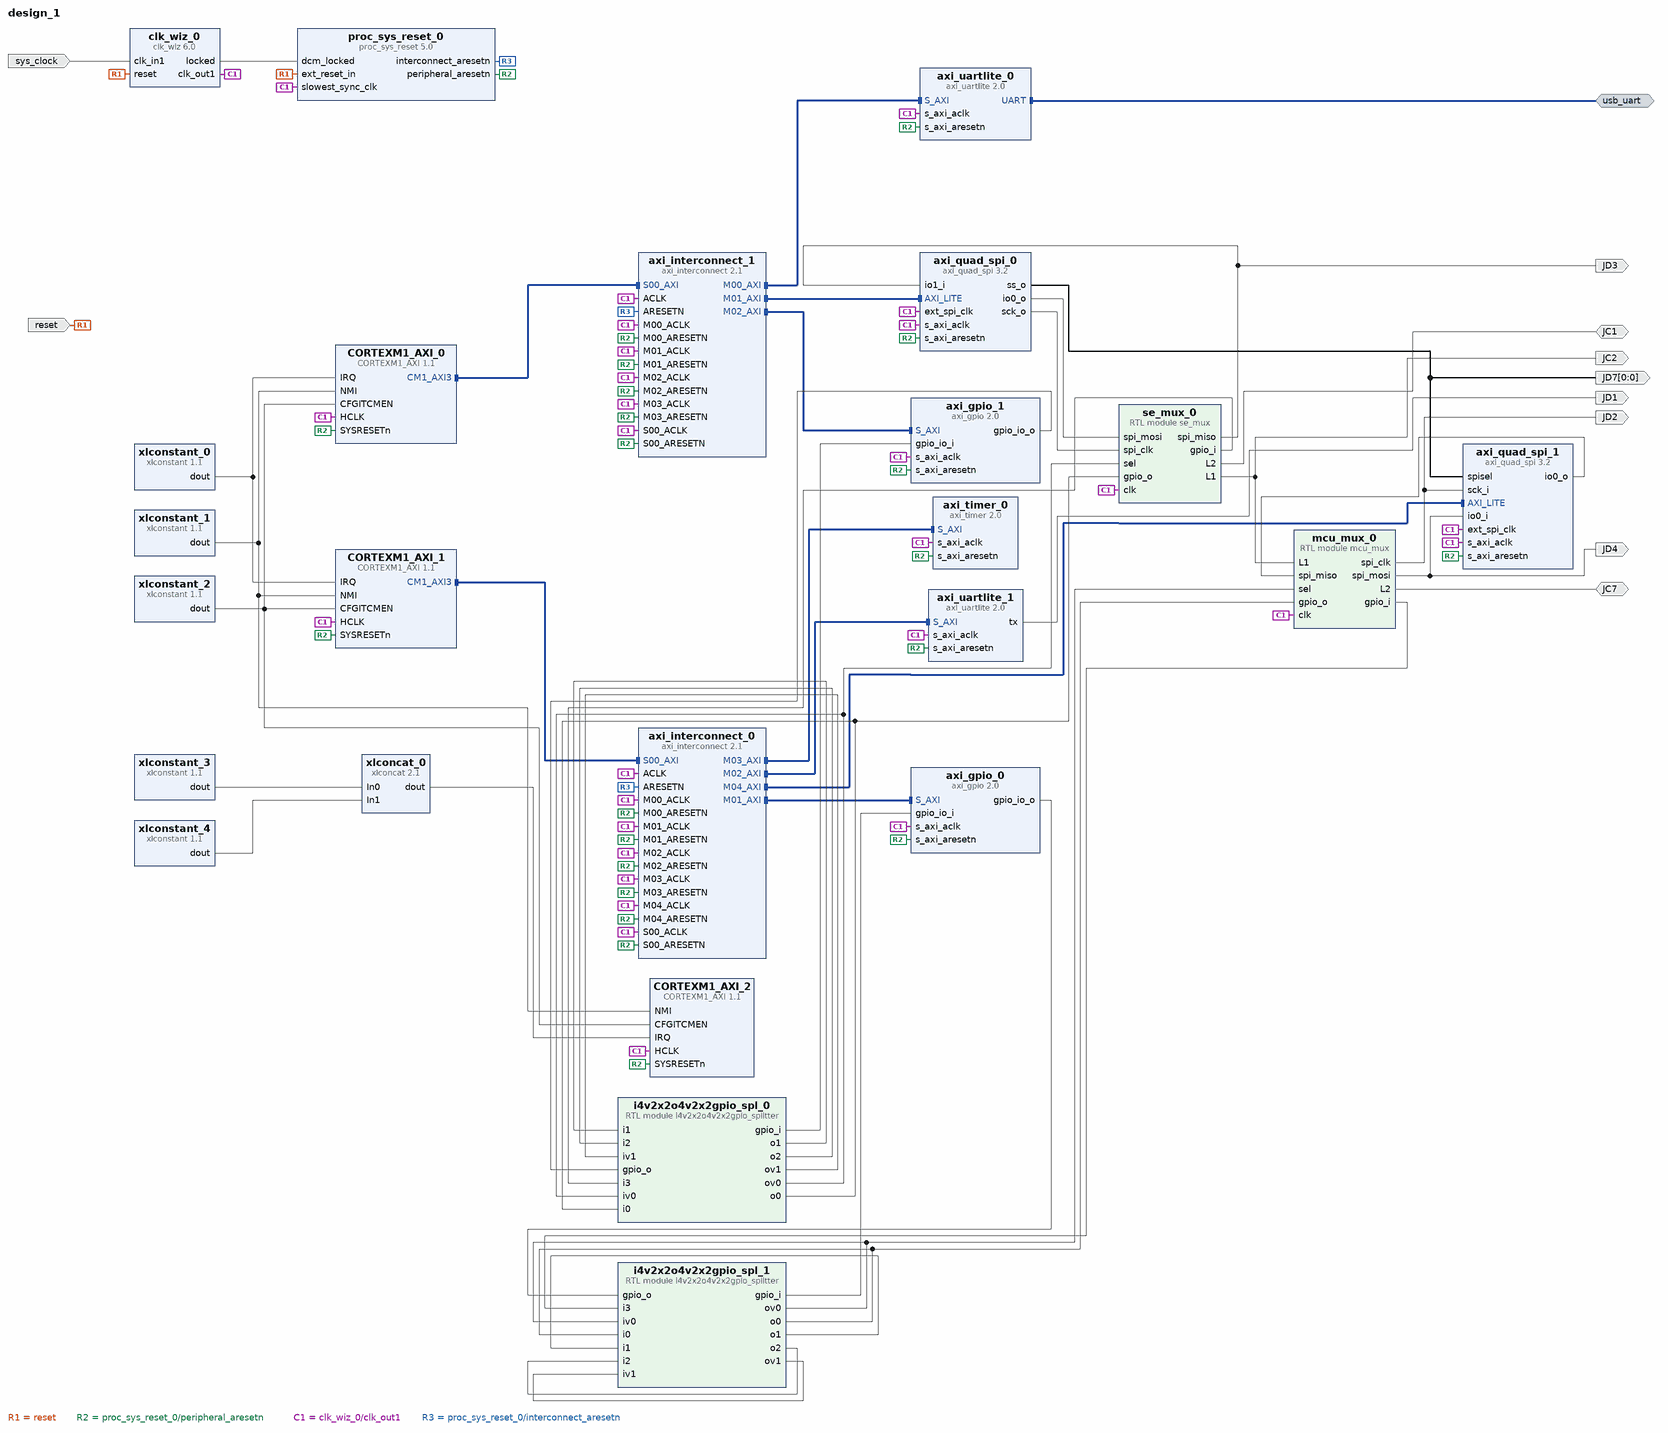
[diagram p0: block diagram of the top level]
# Vivado block design design_1, xc7a100tcsg324-1, Vivado 2019.1
create_bd_design design_1

create_bd_intf_port -mode Master -vlnv xilinx.com:interface:uart_rtl:1.0 usb_uart
create_bd_port -dir I -type clk sys_clock
set_property -dict {CONFIG.FREQ_HZ 100000000 CONFIG.PHASE 0.000} [get_bd_ports sys_clock]
create_bd_port -dir I -type rst reset
set_property -dict {CONFIG.POLARITY ACTIVE_HIGH} [get_bd_ports reset]
create_bd_port -dir O JD4
create_bd_port -dir O JD3
create_bd_port -dir O JD2
create_bd_port -dir O JD1
create_bd_port -dir O -from 0 -to 0 JD7
create_bd_port -dir IO JC1
create_bd_port -dir O JC2
create_bd_port -dir IO JC7

create_bd_cell -type ip -vlnv xilinx.com:ip:clk_wiz:6.0 clk_wiz_0
set_property -dict [list \
  CONFIG.CLK_IN1_BOARD_INTERFACE sys_clock \
  CONFIG.RESET_BOARD_INTERFACE reset \
  CONFIG.USE_BOARD_FLOW true \
] [get_bd_cells clk_wiz_0]
create_bd_cell -type ip -vlnv xilinx.com:ip:axi_interconnect:2.1 axi_interconnect_0
set_property -dict {CONFIG.NUM_MI 5} [get_bd_cells axi_interconnect_0]
create_bd_cell -type ip -vlnv xilinx.com:ip:proc_sys_reset:5.0 proc_sys_reset_0
create_bd_cell -type ip -vlnv xilinx.com:ip:xlconstant:1.1 xlconstant_1
set_property -dict {CONFIG.CONST_VAL 0} [get_bd_cells xlconstant_1]
create_bd_cell -type ip -vlnv xilinx.com:ip:xlconstant:1.1 xlconstant_2
set_property -dict {CONFIG.CONST_VAL 3 CONFIG.CONST_WIDTH 2} [get_bd_cells xlconstant_2]
create_bd_cell -type ip -vlnv arm.com:CortexM:CORTEXM1_AXI:1.1 CORTEXM1_AXI_1
set_property -dict [list \
  CONFIG.DEBUG_SEL 3 \
  CONFIG.ITCM_INIT_RAM true \
  CONFIG.OS true \
  CONFIG.SMALL_MUL false \
] [get_bd_cells CORTEXM1_AXI_1]
create_bd_cell -type ip -vlnv xilinx.com:ip:axi_gpio:2.0 axi_gpio_0
set_property -dict {CONFIG.C_ALL_INPUTS 0 CONFIG.C_GPIO_WIDTH 16 CONFIG.GPIO_BOARD_INTERFACE Custom} [get_bd_cells axi_gpio_0]
create_bd_cell -type ip -vlnv xilinx.com:ip:axi_timer:2.0 axi_timer_0
create_bd_cell -type ip -vlnv xilinx.com:ip:xlconstant:1.1 xlconstant_0
set_property -dict {CONFIG.CONST_VAL 0 CONFIG.CONST_WIDTH 8} [get_bd_cells xlconstant_0]
create_bd_cell -type ip -vlnv arm.com:CortexM:CORTEXM1_AXI:1.1 CORTEXM1_AXI_0
set_property -dict {CONFIG.DEBUG_SEL 3 CONFIG.ITCM_INIT_RAM true CONFIG.OS true} [get_bd_cells CORTEXM1_AXI_0]
create_bd_cell -type ip -vlnv xilinx.com:ip:axi_interconnect:2.1 axi_interconnect_1
set_property -dict {CONFIG.NUM_MI 4} [get_bd_cells axi_interconnect_1]
create_bd_cell -type ip -vlnv xilinx.com:ip:axi_uartlite:2.0 axi_uartlite_0
set_property -dict {CONFIG.UARTLITE_BOARD_INTERFACE usb_uart} [get_bd_cells axi_uartlite_0]
create_bd_cell -type ip -vlnv xilinx.com:ip:axi_uartlite:2.0 axi_uartlite_1
set_property -dict {CONFIG.UARTLITE_BOARD_INTERFACE usb_uart} [get_bd_cells axi_uartlite_1]
create_bd_cell -type ip -vlnv xilinx.com:ip:axi_quad_spi:3.2 axi_quad_spi_0
set_property -dict {CONFIG.C_FIFO_DEPTH 16 CONFIG.C_USE_STARTUP 0 CONFIG.FIFO_INCLUDED 0} [get_bd_cells axi_quad_spi_0]
create_bd_cell -type ip -vlnv xilinx.com:ip:axi_quad_spi:3.2 axi_quad_spi_1
set_property -dict {CONFIG.C_FIFO_DEPTH 16 CONFIG.FIFO_INCLUDED 0 CONFIG.Master_mode 0} [get_bd_cells axi_quad_spi_1]
create_bd_cell -type ip -vlnv xilinx.com:ip:axi_gpio:2.0 axi_gpio_1
set_property -dict {CONFIG.C_GPIO_WIDTH 16} [get_bd_cells axi_gpio_1]
create_bd_cell -type module -reference i4v2x2o4v2x2gpio_splitter i4v2x2o4v2x2gpio_spl_0
create_bd_cell -type module -reference i4v2x2o4v2x2gpio_splitter i4v2x2o4v2x2gpio_spl_1
create_bd_cell -type module -reference mcu_mux mcu_mux_0
create_bd_cell -type module -reference se_mux se_mux_0
create_bd_cell -type ip -vlnv arm.com:CortexM:CORTEXM1_AXI:1.1 CORTEXM1_AXI_2
set_property -dict {CONFIG.DEBUG_SEL 3} [get_bd_cells CORTEXM1_AXI_2]
create_bd_cell -type ip -vlnv xilinx.com:ip:xlconcat:2.1 xlconcat_0
set_property -dict {CONFIG.IN0_WIDTH 16 CONFIG.IN1_WIDTH 16 CONFIG.NUM_PORTS 2} [get_bd_cells xlconcat_0]
create_bd_cell -type ip -vlnv xilinx.com:ip:xlconstant:1.1 xlconstant_3
set_property -dict {CONFIG.CONST_WIDTH 16} [get_bd_cells xlconstant_3]
create_bd_cell -type ip -vlnv xilinx.com:ip:xlconstant:1.1 xlconstant_4
set_property -dict {CONFIG.CONST_WIDTH 16} [get_bd_cells xlconstant_4]

# ---- connections ----

connect_bd_intf_net [get_bd_intf_pins CORTEXM1_AXI_1/CM1_AXI3] [get_bd_intf_pins axi_interconnect_0/S00_AXI]
connect_bd_intf_net [get_bd_intf_ports usb_uart] [get_bd_intf_pins axi_uartlite_0/UART]
connect_bd_intf_net [get_bd_intf_pins axi_interconnect_0/M03_AXI] [get_bd_intf_pins axi_timer_0/S_AXI]
connect_bd_intf_net [get_bd_intf_pins axi_interconnect_1/M02_AXI] [get_bd_intf_pins axi_gpio_1/S_AXI]
connect_bd_intf_net [get_bd_intf_pins axi_interconnect_0/M04_AXI] [get_bd_intf_pins axi_quad_spi_1/AXI_LITE]
connect_bd_intf_net [get_bd_intf_pins axi_interconnect_0/M01_AXI] [get_bd_intf_pins axi_gpio_0/S_AXI]
connect_bd_intf_net [get_bd_intf_pins axi_interconnect_0/M02_AXI] [get_bd_intf_pins axi_uartlite_1/S_AXI]
connect_bd_intf_net [get_bd_intf_pins axi_interconnect_1/M01_AXI] [get_bd_intf_pins axi_quad_spi_0/AXI_LITE]
connect_bd_intf_net [get_bd_intf_pins axi_interconnect_1/M00_AXI] [get_bd_intf_pins axi_uartlite_0/S_AXI]
connect_bd_intf_net [get_bd_intf_pins CORTEXM1_AXI_0/CM1_AXI3] [get_bd_intf_pins axi_interconnect_1/S00_AXI]
connect_bd_net [get_bd_ports sys_clock] [get_bd_pins clk_wiz_0/clk_in1]
connect_bd_net [get_bd_ports reset] [get_bd_pins clk_wiz_0/reset] [get_bd_pins proc_sys_reset_0/ext_reset_in]
connect_bd_net [get_bd_pins proc_sys_reset_0/peripheral_aresetn] \
  [get_bd_pins axi_interconnect_0/M00_ARESETN] [get_bd_pins axi_interconnect_0/S00_ARESETN] \
  [get_bd_pins axi_interconnect_0/M01_ARESETN] [get_bd_pins CORTEXM1_AXI_1/SYSRESETn] [get_bd_pins axi_gpio_0/s_axi_aresetn] \
  [get_bd_pins axi_interconnect_0/M02_ARESETN] [get_bd_pins axi_interconnect_0/M03_ARESETN] \
  [get_bd_pins axi_timer_0/s_axi_aresetn] [get_bd_pins axi_interconnect_0/M04_ARESETN] \
  [get_bd_pins axi_interconnect_1/M00_ARESETN] [get_bd_pins axi_interconnect_1/S00_ARESETN] \
  [get_bd_pins CORTEXM1_AXI_0/SYSRESETn] [get_bd_pins axi_uartlite_0/s_axi_aresetn] \
  [get_bd_pins axi_uartlite_1/s_axi_aresetn] [get_bd_pins axi_quad_spi_1/s_axi_aresetn] \
  [get_bd_pins axi_quad_spi_0/s_axi_aresetn] [get_bd_pins axi_interconnect_1/M02_ARESETN] \
  [get_bd_pins axi_interconnect_1/M01_ARESETN] [get_bd_pins axi_interconnect_1/M03_ARESETN] \
  [get_bd_pins axi_gpio_1/s_axi_aresetn] [get_bd_pins CORTEXM1_AXI_2/SYSRESETn]
connect_bd_net [get_bd_pins clk_wiz_0/clk_out1] \
  [get_bd_pins proc_sys_reset_0/slowest_sync_clk] [get_bd_pins axi_interconnect_0/ACLK] \
  [get_bd_pins axi_interconnect_0/S00_ACLK] [get_bd_pins axi_interconnect_0/M00_ACLK] \
  [get_bd_pins axi_interconnect_0/M01_ACLK] [get_bd_pins CORTEXM1_AXI_1/HCLK] [get_bd_pins axi_gpio_0/s_axi_aclk] \
  [get_bd_pins axi_interconnect_0/M02_ACLK] [get_bd_pins axi_interconnect_0/M03_ACLK] [get_bd_pins axi_timer_0/s_axi_aclk] \
  [get_bd_pins axi_interconnect_0/M04_ACLK] [get_bd_pins CORTEXM1_AXI_0/HCLK] [get_bd_pins axi_interconnect_1/ACLK] \
  [get_bd_pins axi_interconnect_1/S00_ACLK] [get_bd_pins axi_interconnect_1/M00_ACLK] [get_bd_pins axi_uartlite_0/s_axi_aclk] \
  [get_bd_pins axi_uartlite_1/s_axi_aclk] [get_bd_pins axi_quad_spi_0/s_axi_aclk] [get_bd_pins axi_quad_spi_1/s_axi_aclk] \
  [get_bd_pins axi_quad_spi_0/ext_spi_clk] [get_bd_pins axi_quad_spi_1/ext_spi_clk] [get_bd_pins axi_interconnect_1/M02_ACLK] \
  [get_bd_pins axi_interconnect_1/M01_ACLK] [get_bd_pins axi_interconnect_1/M03_ACLK] [get_bd_pins axi_gpio_1/s_axi_aclk] \
  [get_bd_pins mcu_mux_0/clk] [get_bd_pins se_mux_0/clk] [get_bd_pins CORTEXM1_AXI_2/HCLK]
connect_bd_net [get_bd_pins proc_sys_reset_0/interconnect_aresetn] [get_bd_pins axi_interconnect_0/ARESETN] [get_bd_pins axi_interconnect_1/ARESETN]
connect_bd_net [get_bd_pins clk_wiz_0/locked] [get_bd_pins proc_sys_reset_0/dcm_locked]
connect_bd_net [get_bd_pins xlconstant_1/dout] [get_bd_pins CORTEXM1_AXI_1/NMI] [get_bd_pins CORTEXM1_AXI_0/NMI] [get_bd_pins CORTEXM1_AXI_2/NMI]
connect_bd_net [get_bd_pins xlconstant_2/dout] \
  [get_bd_pins CORTEXM1_AXI_1/CFGITCMEN] [get_bd_pins CORTEXM1_AXI_0/CFGITCMEN] [get_bd_pins CORTEXM1_AXI_2/CFGITCMEN]
connect_bd_net [get_bd_pins axi_uartlite_1/tx] [get_bd_ports JD1]
connect_bd_net [get_bd_pins axi_quad_spi_0/ss_o] [get_bd_ports JD7] [get_bd_pins axi_quad_spi_1/spisel]
connect_bd_net [get_bd_ports JC1] [get_bd_pins se_mux_0/L2]
connect_bd_net [get_bd_pins se_mux_0/L1] [get_bd_ports JC2] [get_bd_pins mcu_mux_0/L1]
connect_bd_net [get_bd_ports JC7] [get_bd_pins mcu_mux_0/L2]
connect_bd_net [get_bd_pins axi_quad_spi_1/io0_o] [get_bd_pins mcu_mux_0/spi_miso]
connect_bd_net [get_bd_pins se_mux_0/spi_miso] [get_bd_pins axi_quad_spi_0/io1_i] [get_bd_ports JD3]
connect_bd_net [get_bd_pins axi_quad_spi_0/io0_o] [get_bd_pins se_mux_0/spi_mosi]
connect_bd_net [get_bd_pins mcu_mux_0/spi_mosi] [get_bd_pins axi_quad_spi_1/io0_i] [get_bd_ports JD4]
connect_bd_net [get_bd_pins axi_quad_spi_0/sck_o] [get_bd_pins se_mux_0/spi_clk]
connect_bd_net [get_bd_pins mcu_mux_0/spi_clk] [get_bd_pins axi_quad_spi_1/sck_i] [get_bd_ports JD2]
connect_bd_net [get_bd_pins axi_gpio_1/gpio_io_o] [get_bd_pins i4v2x2o4v2x2gpio_spl_0/gpio_o]
connect_bd_net [get_bd_pins i4v2x2o4v2x2gpio_spl_0/gpio_i] [get_bd_pins axi_gpio_1/gpio_io_i]
connect_bd_net [get_bd_pins i4v2x2o4v2x2gpio_spl_0/ov0] [get_bd_pins se_mux_0/sel] [get_bd_pins i4v2x2o4v2x2gpio_spl_0/iv0]
connect_bd_net [get_bd_pins i4v2x2o4v2x2gpio_spl_0/o0] [get_bd_pins se_mux_0/gpio_o] [get_bd_pins i4v2x2o4v2x2gpio_spl_0/i0]
connect_bd_net [get_bd_pins axi_gpio_0/gpio_io_o] [get_bd_pins i4v2x2o4v2x2gpio_spl_1/gpio_o]
connect_bd_net [get_bd_pins i4v2x2o4v2x2gpio_spl_1/gpio_i] [get_bd_pins axi_gpio_0/gpio_io_i]
connect_bd_net [get_bd_pins i4v2x2o4v2x2gpio_spl_1/ov0] [get_bd_pins mcu_mux_0/sel] [get_bd_pins i4v2x2o4v2x2gpio_spl_1/iv0]
connect_bd_net [get_bd_pins i4v2x2o4v2x2gpio_spl_1/o0] [get_bd_pins mcu_mux_0/gpio_o] [get_bd_pins i4v2x2o4v2x2gpio_spl_1/i0]
connect_bd_net [get_bd_pins se_mux_0/gpio_i] [get_bd_pins i4v2x2o4v2x2gpio_spl_0/i3]
connect_bd_net [get_bd_pins i4v2x2o4v2x2gpio_spl_0/o1] [get_bd_pins i4v2x2o4v2x2gpio_spl_0/i1]
connect_bd_net [get_bd_pins i4v2x2o4v2x2gpio_spl_0/o2] [get_bd_pins i4v2x2o4v2x2gpio_spl_0/i2]
connect_bd_net [get_bd_pins i4v2x2o4v2x2gpio_spl_0/ov1] [get_bd_pins i4v2x2o4v2x2gpio_spl_0/iv1]
connect_bd_net [get_bd_pins mcu_mux_0/gpio_i] [get_bd_pins i4v2x2o4v2x2gpio_spl_1/i3]
connect_bd_net [get_bd_pins i4v2x2o4v2x2gpio_spl_1/o1] [get_bd_pins i4v2x2o4v2x2gpio_spl_1/i1]
connect_bd_net [get_bd_pins i4v2x2o4v2x2gpio_spl_1/o2] [get_bd_pins i4v2x2o4v2x2gpio_spl_1/i2]
connect_bd_net [get_bd_pins i4v2x2o4v2x2gpio_spl_1/ov1] [get_bd_pins i4v2x2o4v2x2gpio_spl_1/iv1]
connect_bd_net [get_bd_pins xlconstant_3/dout] [get_bd_pins xlconcat_0/In0]
connect_bd_net [get_bd_pins xlconstant_4/dout] [get_bd_pins xlconcat_0/In1]
connect_bd_net [get_bd_pins xlconstant_0/dout] [get_bd_pins CORTEXM1_AXI_1/IRQ] [get_bd_pins CORTEXM1_AXI_0/IRQ]
connect_bd_net [get_bd_pins xlconcat_0/dout] [get_bd_pins CORTEXM1_AXI_2/IRQ]

# ---- address map ----
assign_bd_address -offset 0x40000000 -range 64K -target_address_space [get_bd_addr_spaces CORTEXM1_AXI_0/CM1_AXI3] [get_bd_addr_segs axi_gpio_1/S_AXI/Reg]
assign_bd_address -offset 0x40600000 -range 64K -target_address_space [get_bd_addr_spaces CORTEXM1_AXI_0/CM1_AXI3] [get_bd_addr_segs axi_uartlite_0/S_AXI/Reg]
assign_bd_address -offset 0x44A00000 -range 64K -target_address_space [get_bd_addr_spaces CORTEXM1_AXI_0/CM1_AXI3] [get_bd_addr_segs axi_quad_spi_0/AXI_LITE/Reg]
assign_bd_address -offset 0x40000000 -range 64K -target_address_space [get_bd_addr_spaces CORTEXM1_AXI_1/CM1_AXI3] [get_bd_addr_segs axi_gpio_0/S_AXI/Reg]
assign_bd_address -offset 0x40600000 -range 64K -target_address_space [get_bd_addr_spaces CORTEXM1_AXI_1/CM1_AXI3] [get_bd_addr_segs axi_uartlite_1/S_AXI/Reg]
assign_bd_address -offset 0x41C00000 -range 64K -target_address_space [get_bd_addr_spaces CORTEXM1_AXI_1/CM1_AXI3] [get_bd_addr_segs axi_timer_0/S_AXI/Reg]
assign_bd_address -offset 0x44A00000 -range 64K -target_address_space [get_bd_addr_spaces CORTEXM1_AXI_1/CM1_AXI3] [get_bd_addr_segs axi_quad_spi_1/AXI_LITE/Reg]

validate_bd_design
save_bd_design
